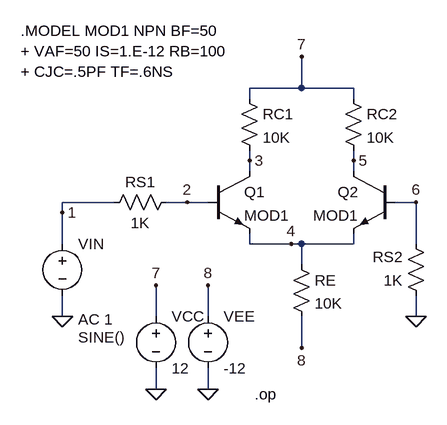
[diagram p0: schematic Fig_3-21_OP.asc]
Fig_3-21_OP.asc, the LTspice schematic file:
Version 4
SHEET 1 4496 832
WIRE 240 -64 240 -112
WIRE 240 -64 160 -64
WIRE 320 -64 240 -64
WIRE 160 -48 160 -64
WIRE 320 -48 320 -64
WIRE 160 48 160 32
WIRE 320 48 320 32
WIRE 160 64 160 48
WIRE 320 64 320 48
WIRE -48 112 -128 112
WIRE 64 112 32 112
WIRE 96 112 64 112
WIRE 416 112 384 112
WIRE -128 128 -128 112
WIRE -128 176 -128 128
WIRE 160 176 160 160
WIRE 224 176 160 176
WIRE 240 176 224 176
WIRE 320 176 320 160
WIRE 320 176 240 176
WIRE 416 176 416 112
WIRE 240 208 240 176
WIRE -128 288 -128 256
WIRE 16 288 16 240
WIRE 96 288 96 240
WIRE 416 288 416 256
WIRE 240 336 240 288
WIRE 16 400 16 368
WIRE 96 400 96 368
FLAG 16 400 0
FLAG 96 400 0
FLAG 16 240 7
FLAG 96 240 8
FLAG -128 288 0
FLAG -128 128 1
FLAG 224 176 4
FLAG 64 112 2
FLAG 160 48 3
FLAG 416 112 6
FLAG 320 48 5
FLAG 416 288 0
FLAG 240 336 8
FLAG 240 -112 7
SYMBOL voltage 16 272 R0
SYMATTR InstName VCC
SYMATTR Value 12
SYMBOL voltage 96 272 R0
WINDOW 123 0 0 Left 2
WINDOW 39 0 0 Left 2
SYMATTR InstName VEE
SYMATTR Value -12
SYMBOL voltage -128 160 R0
WINDOW 3 24 160 Left 2
WINDOW 123 24 132 Left 2
WINDOW 39 0 0 Left 2
SYMATTR Value SINE()
SYMATTR Value2 AC 1
SYMATTR InstName VIN
SYMBOL npn 96 64 R0
SYMATTR InstName Q1
SYMATTR Value MOD1
SYMBOL npn 384 64 M0
SYMATTR InstName Q2
SYMATTR Value MOD1
SYMBOL res 144 -64 R0
SYMATTR InstName RC1
SYMATTR Value 10K
SYMBOL res 304 -64 R0
SYMATTR InstName RC2
SYMATTR Value 10K
SYMBOL res -64 128 R270
WINDOW 0 32 56 VTop 2
WINDOW 3 0 56 VBottom 2
SYMATTR InstName RS1
SYMATTR Value 1K
SYMBOL res 432 272 R180
WINDOW 0 36 76 Left 2
WINDOW 3 36 40 Left 2
SYMATTR InstName RS2
SYMATTR Value 1K
SYMBOL res 224 192 R0
SYMATTR InstName RE
SYMATTR Value 10K
TEXT 168 408 Left 2 !.op
TEXT -192 -152 Left 2 !.MODEL MOD1 NPN BF=50\n+ VAF=50 IS=1.E-12 RB=100\n+ CJC=.5PF TF=.6NS

The netlist it stands for:
* Fig_3-21_OP.asc
VCC 7 0 12
VEE 8 0 -12
VIN 1 0 SINE() AC 1
Q1 3 2 4 0 MOD1
Q2 5 6 4 0 MOD1
RC1 7 3 10K
RC2 7 5 10K
RS1 1 2 1K
RS2 0 6 1K
RE 4 8 10K
.model NPN NPN
.model PNP PNP
.lib standard.bjt
.op
.MODEL MOD1 NPN BF=50
+ VAF=50 IS=1.E-12 RB=100
+ CJC=.5PF TF=.6NS
.backanno
.end